# EAGLE design hackfest (EAGLE 9.6.2)
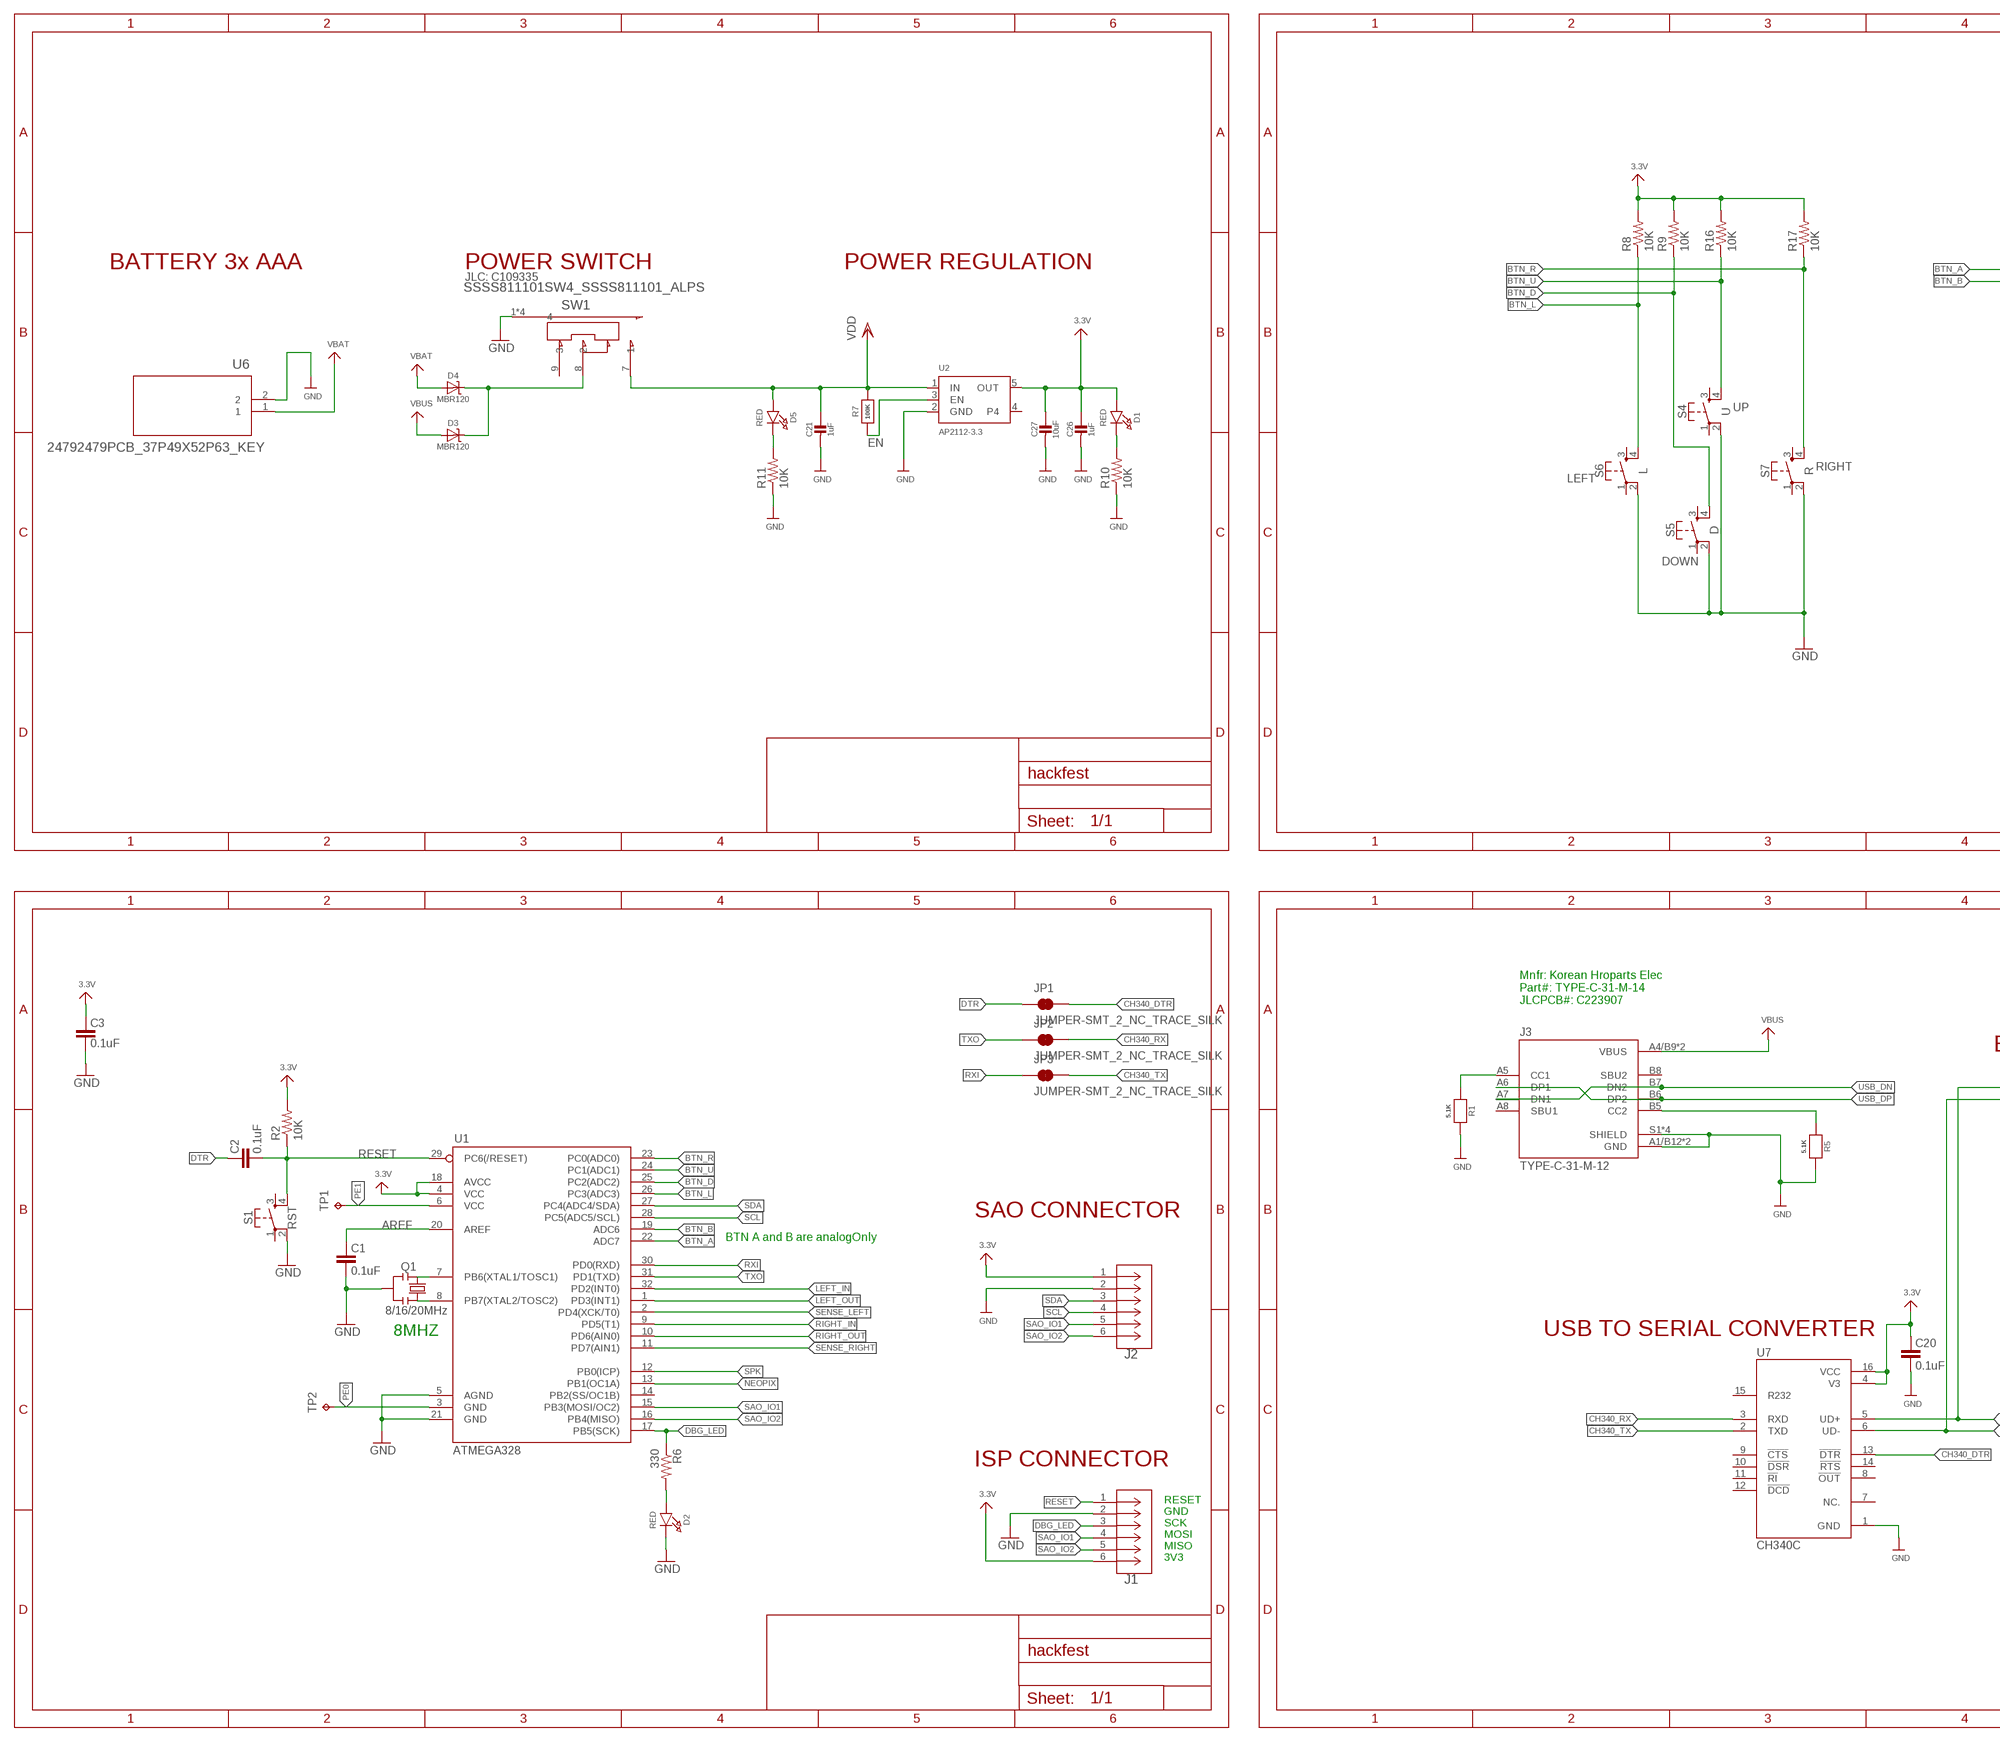
[diagram p0: schematic, sheet 1, part 1 of 2]
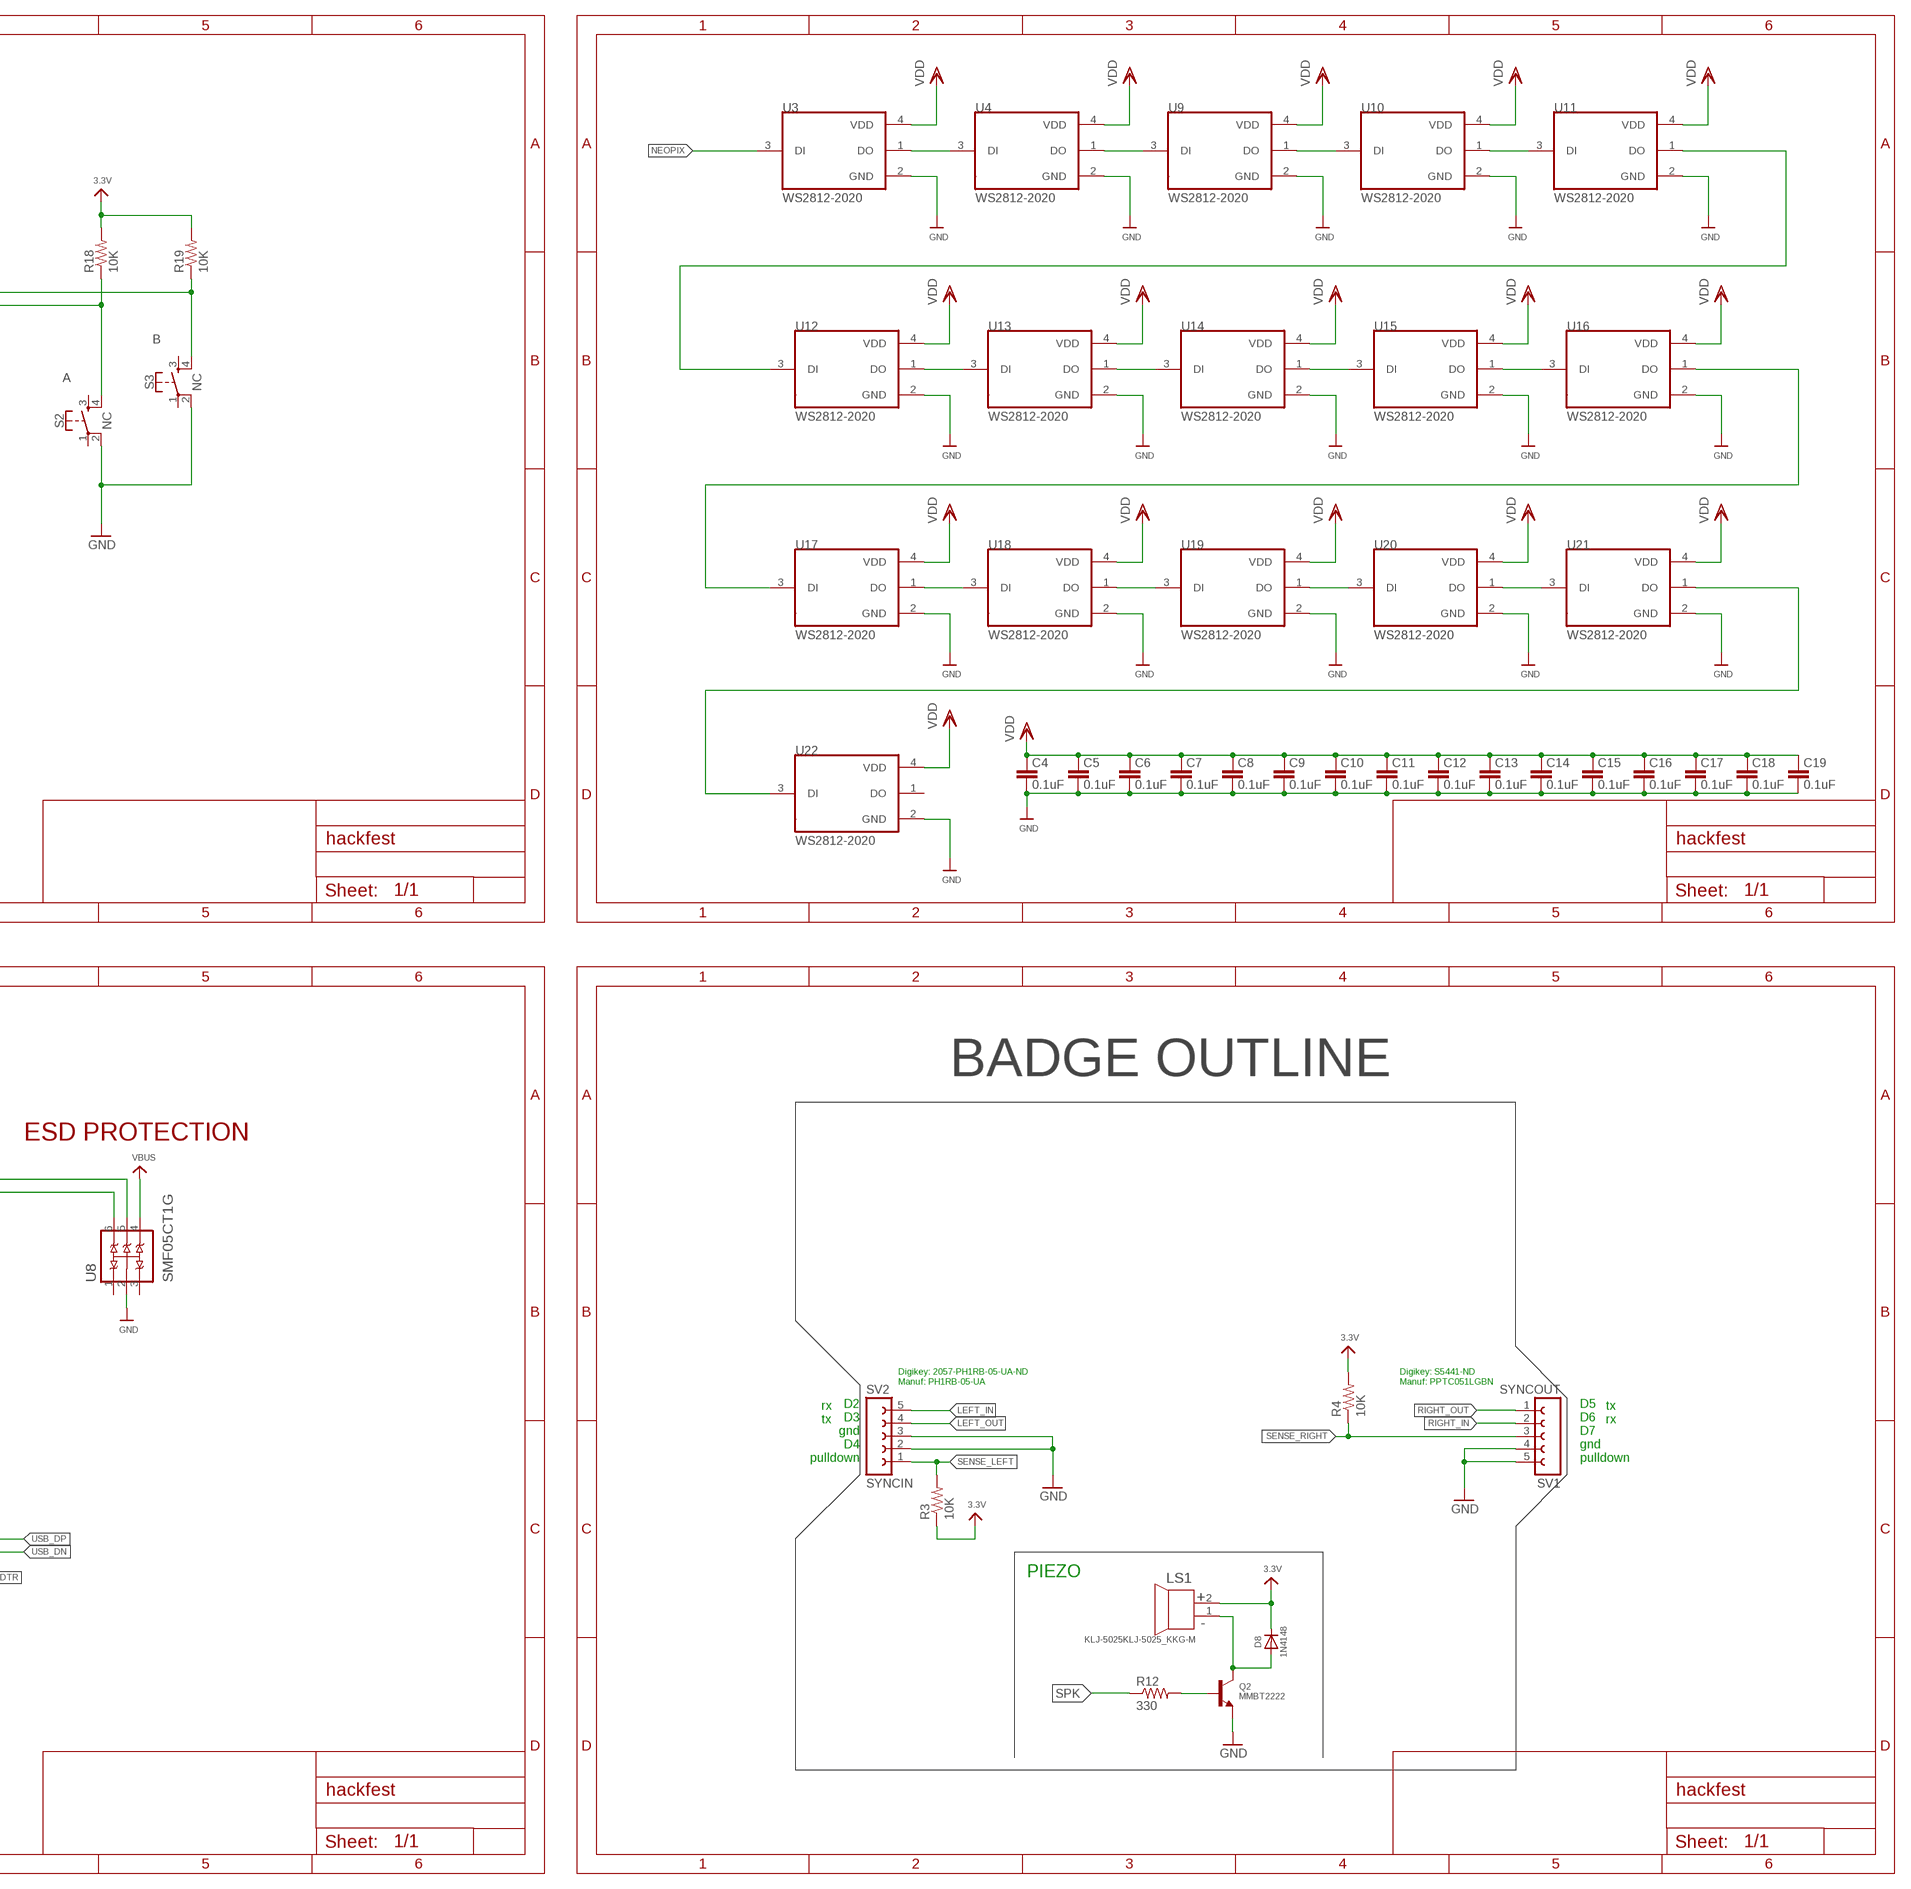
[diagram p1: schematic, sheet 1, part 2 of 2]

## Parts
C1  0.1uF  CAP0603-CAP  [0603-CAP]
C2  0.1uF  CAP0603-CAP  [0603-CAP]
C3  0.1uF  CAP0603-CAP  [0603-CAP]
C4  0.1uF  CAP0603-CAP  [0603-CAP]
C5  0.1uF  CAP0603-CAP  [0603-CAP]
C6  0.1uF  CAP0603-CAP  [0603-CAP]
C7  0.1uF  CAP0603-CAP  [0603-CAP]
C8  0.1uF  CAP0603-CAP  [0603-CAP]
C9  0.1uF  CAP0603-CAP  [0603-CAP]
C10  0.1uF  CAP0603-CAP  [0603-CAP]
C11  0.1uF  CAP0603-CAP  [0603-CAP]
C12  0.1uF  CAP0603-CAP  [0603-CAP]
C13  0.1uF  CAP0603-CAP  [0603-CAP]
C14  0.1uF  CAP0603-CAP  [0603-CAP]
C15  0.1uF  CAP0603-CAP  [0603-CAP]
C16  0.1uF  CAP0603-CAP  [0603-CAP]
C17  0.1uF  CAP0603-CAP  [0603-CAP]
C18  0.1uF  CAP0603-CAP  [0603-CAP]
C19  0.1uF  CAP0603-CAP  [0603-CAP]
C20  0.1uF  CAP0603-CAP  [0603-CAP]
C21  1uF  CAP_CERAMIC0603_NO  [0603-NO@1]
C26  1uF  CAP_CERAMIC0603_NO  [0603-NO@1]
C27  10uF  CAP_CERAMIC0805-NOOUTLINE  [0805-NO]
D1  RED  LED0805_NOOUTLINE  [CHIPLED_0805_NOOUTLINE]
D2  RED  LED0805_NOOUTLINE  [CHIPLED_0805_NOOUTLINE]
D3  MBR120  DIODE-SCHOTTKYSOD-123  [SOD-123]
D4  MBR120  DIODE-SCHOTTKYSOD-123  [SOD-123]
D5  RED  LED0805_NOOUTLINE  [CHIPLED_0805_NOOUTLINE]
D8  1N4148  DIODESOD-323  [SOD-323]
J1  SSW-103-22-F-D-VS-K-TRCON3_SSW-D-DUMZ_HDR_SAI  [CON3_SSW-D-DUMZ_HDR_SAI]
J2  SSW-103-22-F-D-VS-K-TRCON3_SSW-D-DUMZ_HDR_SAI  [CON3_SSW-D-DUMZ_HDR_SAI]
J3  TYPE-C-31-M-12  [HRO_TYPE-C-31-M-12]
JP1  JUMPER-SMT_2_NC_TRACE_SILK  [SMT-JUMPER_2_NC_TRACE_SILK]
JP2  JUMPER-SMT_2_NC_TRACE_SILK  [SMT-JUMPER_2_NC_TRACE_SILK]
JP3  JUMPER-SMT_2_NC_TRACE_SILK  [SMT-JUMPER_2_NC_TRACE_SILK]
LS1  KLJ-5025KLJ-5025_KKG-M  [KLJ-5025_KKG-M]
Q1  8/16/20MHz  RESONATOR1:1  [RESONATOR-SMD-1:1]
Q2  MMBT2222  TRANSISTOR_NPNWIDE  [SOT23-WIDE]
R1  5.1K  RESISTOR_0603_NOOUT  [0603-NO]
R2  10K  RESISTOR0603-RES  [0603-RES]
R3  10K  RESISTOR0603-RES  [0603-RES]
R4  10K  RESISTOR0603-RES  [0603-RES]
R5  5.1K  RESISTOR_0603_NOOUT  [0603-NO]
R6  330  RESISTOR0603-RES  [0603-RES]
R7  100K  RESISTOR_0603_NOOUT  [0603-NO]
R8  10K  RESISTOR0603-RES  [0603-RES]
R9  10K  RESISTOR0603-RES  [0603-RES]
R10  10K  RESISTOR0603-RES  [0603-RES]
R11  10K  RESISTOR0603-RES  [0603-RES]
R12  330  RESISTOR0603-RES  [0603-RES]
R16  10K  RESISTOR0603-RES  [0603-RES]
R17  10K  RESISTOR0603-RES  [0603-RES]
R18  10K  RESISTOR0603-RES  [0603-RES]
R19  10K  RESISTOR0603-RES  [0603-RES]
S1  RST  MOMENTARY-SWITCH-SPST-2-SMD-5.2MM  [TACTILE_SWITCH_SMD_5.2MM]
S2  NC  MOMENTARY-SWITCH-SPST-2-SMD-5.2MM  [TACTILE_SWITCH_SMD_5.2MM]
S3  NC  MOMENTARY-SWITCH-SPST-2-SMD-5.2MM  [TACTILE_SWITCH_SMD_5.2MM]
S4  U  MOMENTARY-SWITCH-SPST-2-SMD-5.2MM  [TACTILE_SWITCH_SMD_5.2MM]
S5  D  MOMENTARY-SWITCH-SPST-2-SMD-5.2MM  [TACTILE_SWITCH_SMD_5.2MM]
S6  L  MOMENTARY-SWITCH-SPST-2-SMD-5.2MM  [TACTILE_SWITCH_SMD_5.2MM]
S7  R  MOMENTARY-SWITCH-SPST-2-SMD-5.2MM  [TACTILE_SWITCH_SMD_5.2MM]
SV1  SYNCOUT  FE05W  [FE05W]
SV2  SYNCIN  FE05W  [FE05W]
SW1  SSSS811101SW4_SSSS811101_ALPS  [SW4_SSSS811101_ALPS]
TP1  TPB1,27  [B1,27]
TP2  TPB1,27  [B1,27]
U1  ATMEGA328  ATMEGA168  [TQFP32-08]
U2  AP2112-3.3  VREG_SOT23-5  [SOT23-5]
U3  WS2812-2020  [LED_WS2812-2020]
U4  WS2812-2020  [LED_WS2812-2020]
U6  24792479PCB_37P49X52P63_KEY  [2479PCB_37P49X52P63_KEY]
U7  CH340C  [SOIC127P600X180-16N]
U8  SMF05CT1G  [SOT65P210X110-6N]
U9  WS2812-2020  [LED_WS2812-2020]
U10  WS2812-2020  [LED_WS2812-2020]
U11  WS2812-2020  [LED_WS2812-2020]
U12  WS2812-2020  [LED_WS2812-2020]
U13  WS2812-2020  [LED_WS2812-2020]
U14  WS2812-2020  [LED_WS2812-2020]
U15  WS2812-2020  [LED_WS2812-2020]
U16  WS2812-2020  [LED_WS2812-2020]
U17  WS2812-2020  [LED_WS2812-2020]
U18  WS2812-2020  [LED_WS2812-2020]
U19  WS2812-2020  [LED_WS2812-2020]
U20  WS2812-2020  [LED_WS2812-2020]
U21  WS2812-2020  [LED_WS2812-2020]
U22  WS2812-2020  [LED_WS2812-2020]

## Nets
3.3V: C3.2 C20.2 C26.1 C27.1 D1.A D8.C J1.6 J2.1 LS1.2 R2.2 R3.1 R4.2 R8.2 R9.2 R16.2 R17.2 R18.2 R19.2 U1.4(VCC) U1.18(AVCC) U2.5(OUT) U7.4(V3) U7.16(VCC)
AREF: C1.2 U1.20(AREF)
BTN_A: R19.1 S3.4 U1.22(ADC7)
BTN_B: R18.1 S2.4 U1.19(ADC6)
BTN_D: R9.1 S5.4 U1.25(PC2(ADC2))
BTN_L: R8.1 S6.4 U1.26(PC3(ADC3))
BTN_R: R17.1 S7.4 U1.23(PC0(ADC0))
BTN_U: R16.1 S4.4 U1.24(PC1(ADC1))
CH340_DTR: JP1.2 U7.13(!DTR)
CH340_RX: JP2.2 U7.3(RXD)
CH340_TX: JP3.2 U7.2(TXD)
DBG_LED: J1.3 R6.1 U1.17(PB5(SCK))
DTR: C2.2 JP1.1
EN: R7.1 U2.3(EN)
GND [vcc]: C1.1 C3.1 C4.1 C5.1 C6.1 C7.1 C8.1 C9.1 C10.1 C11.1 C12.1 C13.1 C14.1 C15.1 C16.1 C17.1 C18.1 C19.1 C20.1 C21.2 C26.2 C27.2 D2.C J1.2 J2.2 J3.A1/B12(GND) J3.B1/A12(GND) J3.S1(SHIELD) J3.S2(SHIELD) J3.S3(SHIELD) J3.S4(SHIELD) Q1.2 Q2.2(E) R1.2 R5.2 R10.1 R11.1 S1.2 S2.2 S3.2 S4.2 S5.2 S6.2 S7.2 SV1.4 SV1.5 SV2.2 SV2.3 SW1.1 SW1.2 SW1.3 SW1.4 U1.5(AGND) U1.21(GND) U2.2(GND) U3.2(GND) U4.2(GND) U6.2 U7.1(GND) U8.2(A) U9.2(GND) U10.2(GND) U11.2(GND) U12.2(GND) U13.2(GND) U14.2(GND) U15.2(GND) U16.2(GND) U17.2(GND) U18.2(GND) U19.2(GND) U20.2(GND) U21.2(GND) U22.2(GND)
LEFT_IN: SV2.5 U1.32(PD2(INT0))
LEFT_OUT: SV2.4 U1.1(PD3(INT1))
N$1: Q1.3 U1.8(PB7(XTAL2/TOSC2))
N$2: Q1.1 U1.7(PB6(XTAL1/TOSC1))
N$3: U4.1(DO) U9.3(DI)
N$4: U9.1(DO) U10.3(DI)
N$5: U3.1(DO) U4.3(DI)
N$6: U10.1(DO) U11.3(DI)
N$7: D2.A R6.2
N$8: U11.1(DO) U12.3(DI)
N$9: U12.1(DO) U13.3(DI)
N$10: U13.1(DO) U14.3(DI)
N$11: U14.1(DO) U15.3(DI)
N$12: U15.1(DO) U16.3(DI)
N$13: U16.1(DO) U17.3(DI)
N$14: U17.1(DO) U18.3(DI)
N$15: U18.1(DO) U19.3(DI)
N$16: U19.1(DO) U20.3(DI)
N$17: U20.1(DO) U21.3(DI)
N$20: U21.1(DO) U22.3(DI)
N$24: D8.A LS1.1 Q2.3(C)
N$25: Q2.1(B) R12.2
N$27: J3.B5(CC2) R5.1
N$30: J3.A5(CC1) R1.1
N$34: D3.C D4.C SW1.8
N$35: D5.C R11.2
N$36: D1.C R10.2
NEOPIX: U1.13(PB1(OC1A)) U3.3(DI)
PE0: TP2.TP U1.3(GND)
PE1: TP1.TP U1.6(VCC)
RESET: C2.1 J1.1 R2.1 S1.4 U1.29(PC6(/RESET))
RIGHT_IN: SV1.2 U1.9(PD5(T1))
RIGHT_OUT: SV1.1 U1.10(PD6(AIN0))
RXI: JP3.1 U1.30(PD0(RXD))
SAO_IO1: J1.4 J2.5 U1.15(PB3(MOSI/OC2))
SAO_IO2: J1.5 J2.6 U1.16(PB4(MISO))
SCL: J2.4 U1.28(PC5(ADC5/SCL))
SDA: J2.3 U1.27(PC4(ADC4/SDA))
SENSE_LEFT: R3.2 SV2.1 U1.2(PD4(XCK/T0))
SENSE_RIGHT: R4.1 SV1.3 U1.11(PD7(AIN1))
SPK: R12.1 U1.12(PB0(ICP))
TXO: JP2.1 U1.31(PD1(TXD))
USB_DN: J3.A7(DN1) J3.B7(DN2) U7.6(UD-) U8.6(C5)
USB_DP: J3.A6(DP1) J3.B6(DP2) U7.5(UD+) U8.5(C4)
VBAT: D4.A U6.1
VBUS: D3.A J3.A4/B9(VBUS) J3.B4/A9(VBUS) U8.4(C3)
VDD: C4.2 C5.2 C6.2 C7.2 C8.2 C9.2 C10.2 C11.2 C12.2 C13.2 C14.2 C15.2 C16.2 C17.2 C18.2 C19.2 C21.1 D5.A R7.2 SW1.7 U2.1(IN) U3.4(VDD) U4.4(VDD) U9.4(VDD) U10.4(VDD) U11.4(VDD) U12.4(VDD) U13.4(VDD) U14.4(VDD) U15.4(VDD) U16.4(VDD) U17.4(VDD) U18.4(VDD) U19.4(VDD) U20.4(VDD) U21.4(VDD) U22.4(VDD)
Unconnected: J3.A8(SBU1) J3.B8(SBU2) S1.1 S1.3 S2.1 S2.3 S3.1 S3.3 S4.1 S4.3 S5.1 S5.3 S6.1 S6.3 S7.1 S7.3 SW1.9 U1.14(PB2(SS/OC1B)) U2.4 U7.7(NC.) U7.8(!OUT) U7.9(!CTS) U7.10(!DSR) U7.11(!RI) U7.12(!DCD) U7.14(!RTS) U7.15(R232) U8.1(C1) U8.3(C2) U22.1(DO)

## Notes on the sheet
- BATTERY 3x AAA | POWER SWITCH | POWER REGULATION
- JLC: C109335
- B
- A
- UP
- RIGHT
- LEFT
- DOWN
- BADGE OUTLINE
- Mnfr: Korean Hroparts Elec
  Part#: TYPE-C-31-M-14
  JLCPCB#: C223907
- ESD PROTECTION
- SAO CONNECTOR
- BTN A and B are analogOnly
- Digikey: 2057-PH1RB-05-UA-ND
  Manuf: PH1RB-05-UA
- Digikey: S5441-ND
  Manuf: PPTC051LGBN
- rx
  tx
- tx
  rx
- 8MHZ | USB TO SERIAL CONVERTER
- D2
  D3
  gnd
  D4
  pulldown
- D5
  D6
  D7
  gnd
  pulldown
- PIEZO
- ISP CONNECTOR
- RESET
  GND
  SCK
  MOSI
  MISO
  3V3

## Library data of the parts
C1-C20 = SparkFun:CAP: Capacitor Standard 0603 ceramic capacitor, and 0.1" leaded capacitor.
C21 C26 C27 = microbuilder:CAP_CERAMIC: Ceramic Capacitors For new designs, use the packages preceded by an '_' character since they are more reliable: The following footprints should be used on most boards: _0402 - Standard footprint for regular board layouts _0603 - Standard footprint for regular board layouts _0805 - Standard footprint for regular board layouts _1206 - Standard footprint for regular board layouts For extremely tight-pitch boards where space is at a premium, the following 'micro-pitch' footprints can be used (smaller pads, no silkscreen outline, etc.): _0402MP - Micro-pitch footprint for very dense/compact boards _0603MP - Micro-pitch footprint for very dense/compact boards _0805MP - Micro-pitch footprint for very dense/compact boards _1206MP - Micro-pitch footprint for very dense/compact boards
D1 D2 D5 = microbuilder:LED: LED 0603 - 0603 Surface Mount Package 2mA: Green LED - Low Power (3.9mcd, 2ma, 1.7Vf) - Digikey: 475-2709-2-ND Orange LED - Low Power (9.8mcd, 2ma, 1.8Vf) - Digikey: 475-1194-2-ND Red LED - Low Power (5mcd, 2ma, 1.8Vf) - Digikey: 475-1195-2-ND Yellow LED - Low Power (7mcd, 2ma, 1.8Vf) - Digikey: 475-1196-2-ND 5mA: Blue LED - Low Power (17mcd, 5ma, 2.9Vf) - Digikey: LNJ937W8CRACT-ND 0805 - 0805 Surface Mount Package 2mA: Red LED (8.8mcd, 2mA, 1.8Vf, Clear) - Low Power [Digikey: 475-2510-1-ND] Green LED (5mcd, 2mA, 1.8Vf, Clear) - Low Power [Digikey: 475-2730-1-ND] Yellow LED (11.3mcd, 2mA, 1.8Vf, Clear) - Low Power [Digikey: 475-2555-1-ND] 20mA: Red LED (104mcd, 20mA, Diffused) - LS R976 [Digikey: 475-1278-6-ND] Red LED (12mcd, 20mA, 2.0Vf, Clear) - APT2012EC [Digikey: 754-1128-1-ND] Green LED (15mcd, 20mA, 2.2Vf, Clear) - APT2012GC [Digikey: 754-1131-1-ND] Orange LED (160mcd, 20mA, 2.1Vf, Clear) - APT2012SECK [Digikey: 754-1130-1-ND] 1206 - 1206 Surface Mount Package Green LED (26mcd, 20mA, Diffused) - LG N971 [Digikey: 475-1407-6-ND] Red LED (15mcd, 20mA, Diffused) - LH N974 [Digikey: 475-1416-6-ND] Cree - Cree High-Power Surface Mount LEDs XPEBWT-L1-0000-00D50 - White 111lm 350mA 2.9Vf 6200K 110° XTEAWT-00-0000-00000LEE3 - White 114lm 350mA 2.85Vf 5000K 115° Everlight - Everlight 45-21 Series Surface Mount LEDs 45-21/QK2C-B2832AC2CB2/2T - Warm White 2000mcd 20mA 3.25Vf 3050K 120° 45-21/LK2C-B38452C4CB2/2T - Nuetral White 2000mcd 20mA 3.25Vf 4150K 120° 45-21/LK2C-B50634C6CB2/2T - Cold White 2200mcd 20mA 3.25Vf 5650K 120° PLCC2 Reverse Mount LS T77K-J1L2-1-0-2-R18-Z - Red 11.25mcd 2mA 1.8Vf 630nm 120° LO T77K-L1M2-24-Z - Orange 19.6mcd 2mA 1.8Vf 606nm 120° LY T77K-K2M1-26-Z - Yellow 15.7mcd 2mA 1.8Vf 587nm 120°
D3 D4 = microbuilder:DIODE-SCHOTTKY
D8 = microbuilder:DIODE: Diode SMA Model Volts Amps Type Vf Ir Digikey # Notes SSA34-E3 40V 3A Schottky 480mV @ 3A 200uA @ 40V SSA34-E3/61TGITR-ND CDBA120-G 20V 1A Schottky 500mV @ 1A 500uA @ 20V 641-1014-6-ND REEL MBRA210 10V 2A Schottky 350mV @ 2A 700uA @ 10V MBRA210LT3 SOD-123 Model Volts Amps Type Vf Ir Order # Notes BAT54T1G 30V 200mA Schottky 800mV @ 200mA 2uA @ 25V BAT54T1GOSTR-ND B0530W 30V 500mA Schottky 430mV @ 500mA 130uA @ 30V B0530W-FDICT-ND REEL MBR120 20V 1A Schottky 340mV @ 1A MBR120VLSFT1GOSCT-ND SOD-323 Model Volts Amps Type Vf Ir Order # Notes PMEG2005EJ 20V 500mA Schottky 355mV @ 500mA 568-4110-1-ND ZLLS410 10V 570mA Schottky 380mV @ 570mA ZLLS410CT-ND 1N4148WS 75V 150mA Silicon/Simple 1V 1N4148WSFSCT-ND REEL SOD-523 Model Volts Amps Type Vf Ir Order # Notes BAT54XV2 30V 200mA Schottky 0.8V @ 100mA BAT54XV2CT-ND TB751S 30V 30mA Schottky RB751S-40TE61CT-ND SOT23-R/W (R = Solder Paste/Reflow Ovens, W = Hand-Soldering) Model Volts Amps Type Vf Ir Order # Notes BAT54FILM 40V 300mA Schottky 497-7162-1-ND POWERDI-5 Model Volts Amps Type Vf Ir Order # Notes PDS560 60V 5A Schottky 670mV @ 5A 150uA @ 60V PDS560DICT-ND
J1 J2 = SSW-103-22-F-D-VS-K-TR:SSW-103-22-F-D-VS-K-TR; COPYRIGHT: Copyright (C) 2022 Ultra Librarian. All rights reserved.; DIGI-KEY_PART_NUMBER_1: SAM14622CT-ND; DIGI-KEY_PART_NUMBER_2: SAM14622DKR-ND; DIGI-KEY_PART_NUMBER_3: SAM14622TR-ND; MANUFACTURER_PART_NUMBER: SSW-103-22-F-D-VS-K-TR; MFR_NAME: Samtec Inc
J3 = TYPE-C-31-M-12:TYPE-C-31-M-12; MANUFACTURER: HRO Electronics Co., Ltd.; MAXIMUM_PACKAGE_HEIGHT: 3.26 mm; PARTREV: 2020.12.08; SNAPEDA_PN: TYPE-C-31-M-12; STANDARD: Manufacturer Recommendations
JP1-JP3 = SparkFun-Jumpers:JUMPER-SMT_2_NC_TRACE: Normally closed trace jumper This jumper has a trace between two pads so it's normally closed (NC). Use a razor knife to open the connection. For best results follow the IPC guidelines for cutting traces: Cutout at least 0.063 mm (0.005 in). Remove all loose material to clean up the cut area. Seal the cut with an approved epoxy. Reapply solder to reclose the connection.
LS1 = KLJ-5025_KKG:KLJ-5025; COPYRIGHT: Copyright (C) 2024 Ultra Librarian. All rights reserved.; MANUFACTURER_PART_NUMBER: KLJ-5025; MFR_NAME: KELIKING
Q1 = Testing:RESONATOR: Resonator Small SMD resonator. This is the itty bitty 10/20MHz resonators with built in caps. CSTCE10M0G55 and CSTCE20M0V53. Footprint for SMD has been used in SFE production for years, and does work okay. 1:1 is an attempt to get larger fillets on the sides so it will be easier to inspect these solders in our AOI machine. The pads have been minimized to match the actual metal under the resonator. To see this relation, it includes an image import of the bottom side of the component. Imported to scale on layer 200.
Q2 = microbuilder:TRANSISTOR_NPN: NPN Transistor Transistor (NPN) 500mA 45V - BC817 [Digikey: 568-1631-1-ND] Transistor (NPN) 500mA 45V - BC817,215 [Mouser: 771-BC817-T/R] SOT23-R - SOT23 footprint optimised for use with solder paste and reflow ovens. SOT23-W - SOT23 footprint optimised for hand-soldering (larger pads).
R1 R5 R7 = microbuilder:RESISTOR: Resistors For new designs, use the packages preceded by an '_' character since they are more reliable: The following footprints should be used on most boards: _0402 - Standard footprint for regular board layouts _0603 - Standard footprint for regular board layouts _0805 - Standard footprint for regular board layouts _1206 - Standard footprint for regular board layouts For extremely tight-pitch boards where space is at a premium, the following 'micro-pitch' footprints can be used (smaller pads, no silkscreen outline, etc.): _0402MP - Micro-pitch footprint for very dense/compact boards _0603MP - Micro-pitch footprint for very dense/compact boards _0805MP - Micro-pitch footprint for very dense/compact boards _1206MP - Micro-pitch footprint for very dense/compact boards
R2-R4 R6 R8-R12 R16-R19 = SparkFun:RESISTOR: Resistor Basic schematic elements and footprints for 0603, 1206, and PTH resistors.
S1-S7 = SparkFun-Switches:MOMENTARY-SWITCH-SPST-2: Momentary Switch (Pushbutton) - SPST - Two Circuits Normally-open (NO) SPST momentary switches (buttons, pushbuttons). Schematic symbol includes two switch circuits. Variants SMD-4.6MMX2.8MM - 4.60mm x 2.80mm Tactile Momentary Button Switch - Used on SparkFun SAMD21 Mini Breakout <https://www.sparkfun.com/products/13664> SMD-5.2MM - Mini Pushbutton Switch - SMD <https://www.sparkfun.com/products/8720> - Used on Arduino Pro Mini <https://www.sparkfun.com/products/11114>; PROD_ID: SWCH-08247; SF_SKU: COM-08720
SV1 SV2 = con-lsta:FE05W: FEMALE HEADER; OC_FARNELL: unknown; OC_NEWARK: unknown
SW1 = SSSS811101:SSSS811101; COPYRIGHT: Copyright (C) 2023 Ultra Librarian. All rights reserved.; MANUFACTURER_PART_NUMBER: SSSS811101; MFR_NAME: Alps Electric
TP1 TP2 = testpad:TP: Test pad
U1 = SparkFun:ATMEGA168
U2 = microbuilder:VREG_SOT23-5: SOT23-5 Fixed Voltage Regulators Part Current Out V Out V In V Dropout θJA (°C/W) TJ (°C) Digikey Part No. ADP121 150mA 3.3V 3.4-5.5V 0.09V @ 150mA -- -- ADP121-AUJZ33R7CT-ND ADP121 150mA 3.0V 3.1-5.5V 0.09V @ 150mA -- -- ADP121-AUJZ30R7CT-ND ADP122 300mA 3.3V 3.4-5.5V 0.085V @ 300mA -- -- ADP122AUJZ-3.3-R7CT-ND ADP1712 300mA 3.3V 3.5-5.5V 0.17V @ 300mA -- -- ADP1712AUJZ-3.3-R7TR-ND AP7311 (Low Cost) 150mA 3.3V 3.5-6V 0.15V @ 150mA -- -- AP7311-33WG-7DICT-ND LD39015M18R 150mA 1.8V 1.9V-5.5V 0.08V @ 100mA -- -- 497-6977-1-ND LP2985A-33DBVR 150mA 3.3V 3.3-16V 0.28V @ 150mA 206 150 296-18479-1-ND MCP1824T-3302E/OT 300mA 3.3V 3.5V-6V 0.2V @ 300mA -- -- MCP1824T-3302E/OTCT-ND MIC5205-2.5YM5 TR 150mA 2.5V 2.7-16V 0.165V @ 150mA -- -- 576-1257-2-ND MIC5205-3.0YM5 TR 150mA 3.0V 3.2V-16V 0.165V @ 150mA -- -- 576-1258-2-ND MIC5205-3.3YM5 TR 150mA 3.3V 3.5V-16V 0.165V @ 150mA -- -- 576-1259-2-ND TPS780330220 150mA 3.3V+2.2V 3.6-5.5V 250mV Max -- -- 296-23332-1-ND TDA3663/N1,135 100mA 3.3V 3.5-45V 0.18V @ 50mA -- -- 568-5343-1-ND Max operating temp can be calculated using θJA, TJ (max junction temperature), and power in watts. Set the "Maximum Ambient Temperature" until it reaches TJ ("Max Junction Temperature"), which is the absolute limit for safe use of the regulator: Heat Sink Temperature Calculator <http://www.daycounter.com/Calculators/Heat-Sink-Temperature-Calculator.phtml> For example, With 12V source into a 3.3V LP2985 and a 30mA load, we are dissipating (12V-3.3V) * 0.03A = 0.261W. With a θJA of 206 °C/W, a TJ of 150°C, and 261mW we can safely use the chip without a heat sink up to 75°C (=147.1°C Junction Temperature).
U3 U4 U9-U22 = WS2812-2020:WS2812-2020: Intelligent control LED integrated light source Check availability <https://pricing.snapeda.com/parts/WS2812-2020/Worldsemi/view-part?ref=eda>; AVAILABILITY: Not in stock; DESCRIPTION: Intelligent control LED light source, SMD-4; MF: Worldsemi; MP: WS2812-2020; PACKAGE: Package; PRICE: None
U6 = 36-2479-ND_AAA-3x:2479; COPYRIGHT: Copyright (C) 2022 Ultra Librarian. All rights reserved.; DIGI-KEY_PART_NUMBER_1: 1528-1350-ND; DIGI-KEY_PART_NUMBER_2: 2183-2479-ND; DIGI-KEY_PART_NUMBER_3: 2479K-ND; DIGI-KEY_PART_NUMBER_4: 36-2479-ND; DIGI-KEY_PART_NUMBER_5: 36-2479-NDL; MANUFACTURER_PART_NUMBER: 2479; MFR_NAME: Keystone Electronics
U7 = CH340C:CH340C: USB to serial chip CH340 Check prices <https://pricing.snapeda.com/parts/CH340C/WCH/view-part?ref=eda>; AVAILABILITY: Not in stock; DESCRIPTION: USB to serial chip CH340; MF: WCH; MP: CH340C; PACKAGE: None; PRICE: None
U8 = SMF05CT1G:SMF05CT1G: SMF05C Series 7.2 V 100 W 5-Line Transient Voltage Suppressor Array - SC-88 Check prices <https://pricing.snapeda.com/parts/SMF05CT1G/ON%20Semiconductor/view-part?ref=eda>; AVAILABILITY: In Stock; DESCRIPTION: 12.5V Clamp 8A (8/20µs) Ipp Tvs Diode Surface Mount SC-88/SC70-6/SOT-363; MF: ON Semiconductor; MP: SMF05CT1G; PACKAGE: SC-88-6 ON Semiconductor; PRICE: None; PURCHASE-URL: https://pricing.snapeda.com/search/part/SMF05CT1G/?ref=eda

## Net classes
1 vcc: width 0.254 mm

## Board
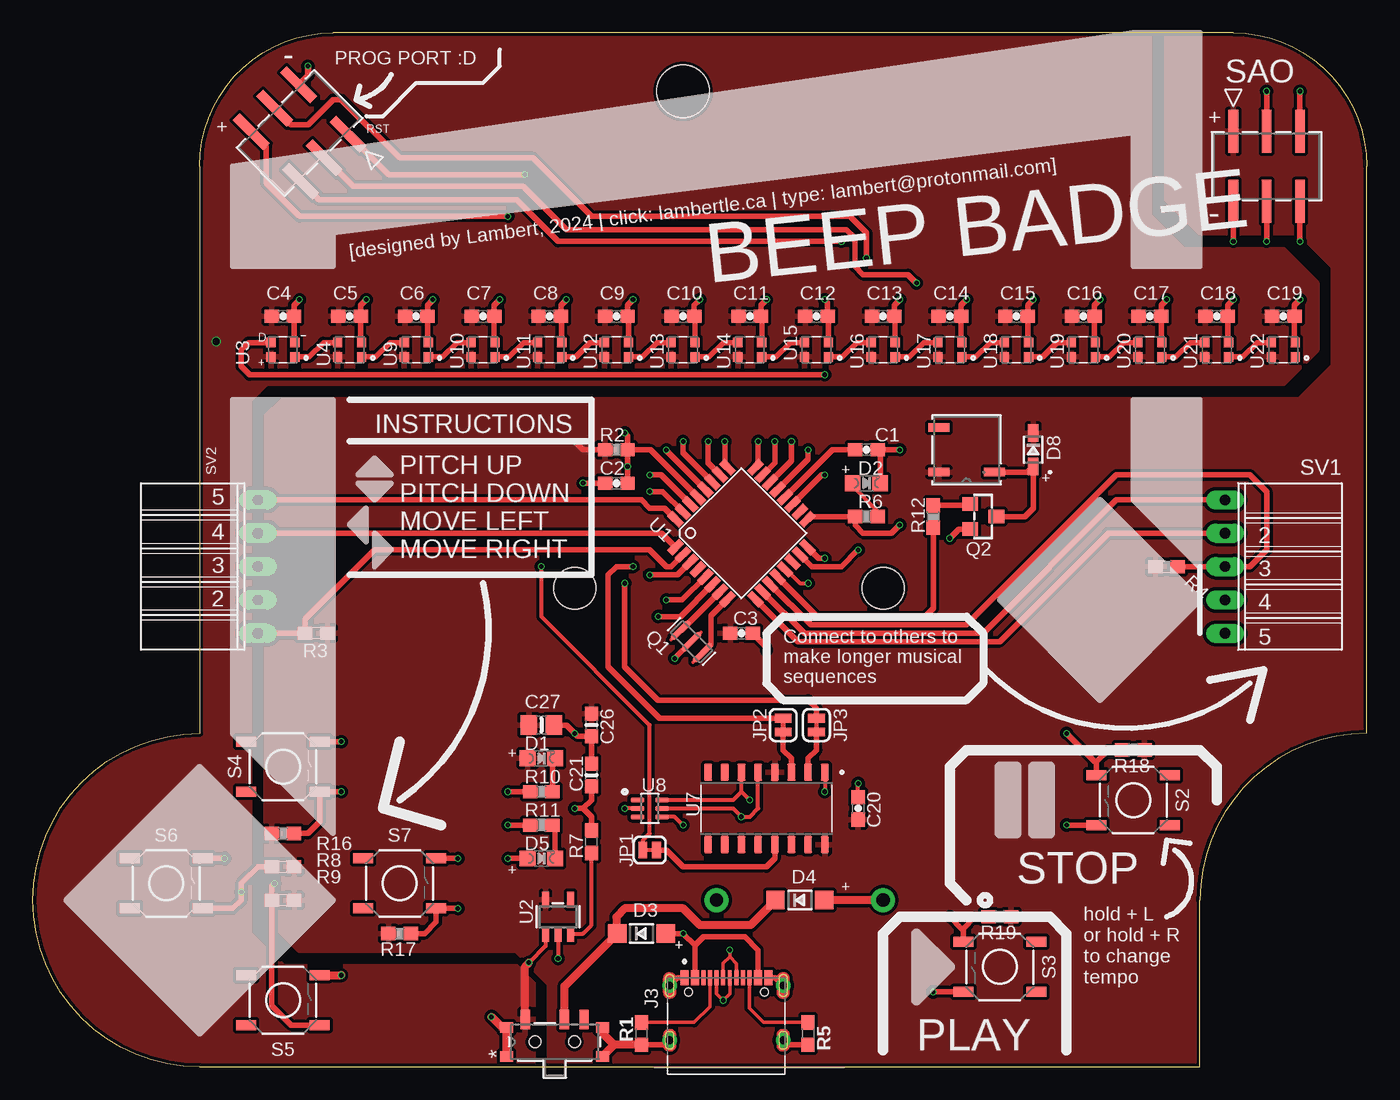
[diagram p2: board, top side]
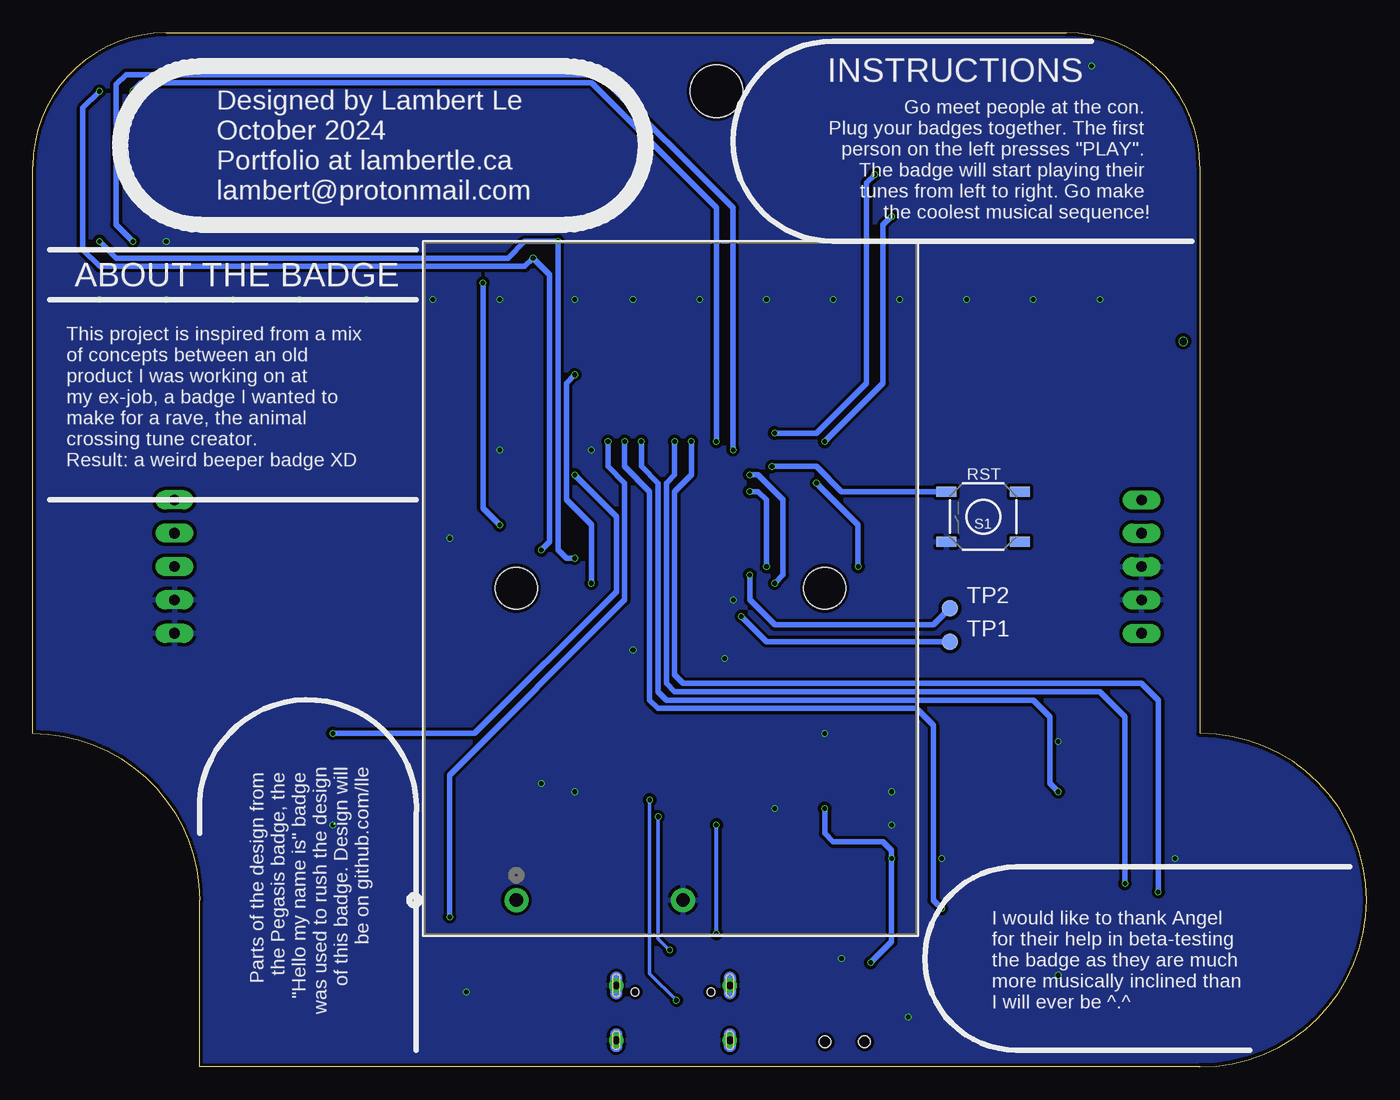
[diagram p3: board, bottom side, seen from below]

Size 101.6 x 78.74 mm. Coordinates in mm from the lower left corner, seen from the top.
Outline: 12.7,0 88.9,0 88.9,12.7 arc-90 101.6,25.4 101.6,68.58 arc90 91.44,78.74 22.86,78.74 arc90 12.7,68.58 12.7,25.4 arc180 12.7,0
Copper layers (1*16): Top 0.035mm / dielectric 1.6mm / Bottom 0.035mm
Design rules "jlcpcb-2layers": minimum track width 5mil, minimum drill 0.3mm, track to track 5mil, track to pad 5mil, pad to pad 5mil, via to via 5mil, smd to smd 5mil, copper to edge 0.2mm, drill to drill 6mil, minimum pad ring 10mil, minimum via ring 3mil, stop-mask expansion 4mil, vias tented up to drill 0mil, thermal gap 10mil
Holes 4 mm at 49.53,74.3

### Footprints (pad centres in the part's own frame; a part is rotated, then mirrored left to right if it is on the bottom)
0603-CAP = smd 1.1 x 1: 1 -0.85,0; 2 0.85,0
0603-NO@1 = smd 1.075 x 1: 1 -0.85,0; 2 0.85,0
0805-NO = smd 1.24 x 1.5: 1 -0.95,0; 2 0.95,0
CHIPLED_0805_NOOUTLINE = smd 1.2 x 1.2: A 0,-1.05; C 0,1.05
SOD-123 = smd 1.4 x 1.4: A 1.85,0; C -1.85,0
SOD-323 = smd 1.35 x 0.8: A 1.27,0; C -1.27,0
CON3_SSW-D-DUMZ_HDR_SAI = smd 0.737 x 3.251: 1 2.54,-2.667; 2 2.54,2.667; 3 0,-2.667; 4 0,2.667; 5 -2.54,-2.667; 6 -2.54,2.667
HRO_TYPE-C-31-M-12 = smd 0.6 x 1.14: A1/B12 -3.2,4.75; A4/B9 -2.4,4.75; B1/A12 3.2,4.75; B4/A9 2.4,4.75 | smd 0.3 x 1.14: A5 -1.25,4.75; A6 -0.25,4.75; A7 0.25,4.75; A8 1.25,4.75; B5 1.75,4.75; B6 0.75,4.75; B7 -0.75,4.75; B8 -1.75,4.75 | drill 0.6 pad 0.9: S1 -4.325,4.17; S2 4.325,4.17; S3 -4.325,0; S4 4.325,0 | hole 0.6: -2.89,3.68; 2.89,3.68
SMT-JUMPER_2_NC_TRACE_SILK = smd 0.66 x 1.27: 1 -0.521,0; 2 0.521,0
KLJ-5025_KKG-M = smd 1.6 x 0.66: 1 -2.108,1.7; 2 2.108,1.7; 3 2.108,-1.7
RESONATOR-SMD-1:1 = smd 0.45 x 1.905: 1 -1.2,0; 2 0,0; 3 1.2,0
SOT23-WIDE = smd 1 x 1.2: 1 -0.95,-1; 2 0.95,-1; 3 0,1
0603-NO = smd 1.1 x 1: 1 -0.85,0; 2 0.85,0
0603-RES = smd 1.1 x 1: 1 -0.85,0; 2 0.85,0
TACTILE_SWITCH_SMD_5.2MM = smd 1.524 x 0.762: 1 -2.794,1.905; 2 2.794,1.905; 3 -2.794,-1.905; 4 2.794,-1.905
FE05W = drill 0.813 long: 1 -5.08,0; 2 -2.54,0; 3 0,0; 4 2.54,0; 5 5.08,0
SW4_SSSS811101_ALPS = smd 0.813 x 0.991: 1 -1.1,3.65; 2 -1.1,-3.65; 3 1.1,-3.65; 4 1.1,3.65 | smd 1.499 x 0.711: 7 1.71,2.243; 8 1.71,-0.742; 9 1.71,-2.24 | hole 0.9: 0,-1.5; 0,1.5
B1,27 = smd 1.27 x 1.27: TP 0,0
TQFP32-08 = smd 1.27 x 0.559: 1 -4.293,2.8; 2 -4.293,2; 3 -4.293,1.2; 4 -4.293,0.4; 5 -4.293,-0.4; 6 -4.293,-1.2; 7 -4.293,-2; 8 -4.293,-2.8; 17 4.293,-2.8; 18 4.293,-2; 19 4.293,-1.2; 20 4.293,-0.4; 21 4.293,0.4; 22 4.293,1.2; 23 4.293,2; 24 4.293,2.8 | smd 0.559 x 1.27: 9 -2.8,-4.293; 10 -2,-4.293; 11 -1.2,-4.293; 12 -0.4,-4.293; 13 0.4,-4.293; 14 1.2,-4.293; 15 2,-4.293; 16 2.8,-4.293; 25 2.8,4.293; 26 2,4.293; 27 1.2,4.293; 28 0.4,4.293; 29 -0.4,4.293; 30 -1.2,4.293; 31 -2,4.293; 32 -2.8,4.293
SOT23-5 = smd 0.55 x 1.2: 1 -0.95,-1.3; 2 0,-1.3; 3 0.95,-1.3; 4 0.95,1.3; 5 -0.95,1.3
LED_WS2812-2020 = smd 0.7 x 0.7: 1 -0.915,0.55; 2 -0.915,-0.55; 3 0.915,-0.55; 4 0.915,0.55
2479PCB_37P49X52P63_KEY = drill 1.016 pad 1.524: 1 0,0; 2 12.7,0 | hole 3.2: 0,23.749; 23.495,23.749
SOIC127P600X180-16N = smd 1.31 x 0.62: 1 -2.75,4.445; 2 -2.75,3.175; 3 -2.75,1.905; 4 -2.75,0.635; 5 -2.75,-0.635; 6 -2.75,-1.905; 7 -2.75,-3.175; 8 -2.75,-4.445; 9 2.75,-4.445; 10 2.75,-3.175; 11 2.75,-1.905; 12 2.75,-0.635; 13 2.75,0.635; 14 2.75,1.905; 15 2.75,3.175; 16 2.75,4.445
SOT65P210X110-6N = smd 1.06 x 0.39: 1 -0.935,0.65; 2 -0.935,0; 3 -0.935,-0.65; 4 0.935,-0.65; 5 0.935,0; 6 0.935,0.65

### Placement (x,y rotation side)
C1  63.5,46.99 180 top
C2  44.45,44.45 180 top
C3  53.98,33.02 180 top
C4  19.05,57.15 180 top
C5  24.13,57.15 180 top
C6  29.21,57.15 180 top
C7  34.29,57.15 180 top
C8  39.37,57.15 180 top
C9  44.45,57.15 180 top
C10  49.53,57.15 180 top
C11  54.61,57.15 180 top
C12  59.69,57.15 180 top
C13  64.77,57.15 180 top
C14  69.85,57.15 180 top
C15  74.93,57.15 180 top
C16  80.01,57.15 180 top
C17  85.09,57.15 180 top
C18  90.17,57.15 180 top
C19  95.25,57.15 180 top
C20  62.86,19.68 270 top
C21  42.55,22.23 90 top
C26  42.55,26.04 270 top
C27  38.73,26.04 0 top
D1  38.73,23.5 270 top
D2  63.5,44.45 270 top
D3  46.35,10.16 0 top
D4  58.42,12.7 0 top
D5  38.73,15.88 270 top
D8  76.2,46.99 270 top
J1  20.32,71.12 45 top
J2  93.98,68.58 180 top
J3  52.83,2.03 0 top
JP1  46.99,16.51 0 top
JP2  57.15,26.04 270 top
JP3  59.69,26.04 270 top
LS1  71.12,46.99 180 top
Q1  50.16,32.38 315 top
Q2  72.39,41.91 270 top
R1  46.35,2.54 270 top
R2  44.45,46.99 180 top
R3  21.59,33.02 180 top
R4  86.36,38.1 180 top
R5  59.05,2.54 270 top
R6  63.5,41.91 0 top
R7  42.55,17.14 90 top
R8  19.05,15.24 0 top
R9  19.05,12.7 0 top
R10  38.73,20.95 0 top
R11  38.73,18.41 0 top
R12  68.58,41.91 90 top
R16  19.05,17.78 180 top
R17  27.94,10.16 180 top
R18  83.82,24.13 0 top
R19  73.66,11.43 0 top
S1  29.21,41.91 180 bottom
S2  83.82,20.32 180 top
S3  73.66,7.62 180 top
S4  19.05,22.86 0 top
S5  19.05,5.08 0 top
S6  10.16,13.97 0 top
S7  27.94,13.97 0 top
SV1  90.8,38.1 270 top
SV2  17.14,38.1 90 top
SW1  39.75,1.91 90 top
TP1  31.75,32.38 0 bottom
TP2  31.75,34.92 0 bottom
U1  53.98,40.64 45 top
U2  40,11.43 0 top
U3  19.05,54.61 180 top
U4  24.13,54.61 180 top
U6  64.77,12.7 0 bottom
U7  55.88,19.68 270 top
U8  46.99,19.68 0 top
U9  29.21,54.61 180 top
U10  34.29,54.61 180 top
U11  39.37,54.61 180 top
U12  44.45,54.61 180 top
U13  49.53,54.61 180 top
U14  54.61,54.61 180 top
U15  59.69,54.61 180 top
U16  64.77,54.61 180 top
U17  69.85,54.61 180 top
U18  74.93,54.61 180 top
U19  80.01,54.61 180 top
U20  85.09,54.61 180 top
U21  90.17,54.61 180 top
U22  95.25,54.61 180 top

### Tracks (layer width: path | path; a pad name or v marks a point on that pad's centre or on a via)
3.3V  (via drill 0.35)
  Top 0.406: R2.2 41.91,46.99 v41.27,47.62 | v36.19,64.77 20.32,64.77 17.78,67.31 17.78,70.07 J1.6
  Bottom 0.406: v41.27,47.62 36.83,52.07 36.83,64.14 v36.19,64.77
  pour Top (isolate 0.254): 17.78,11.43 17.78,49.53 19.05,50.8 96.52,50.8 99.06,53.34 99.06,60.96 96.52,63.5 88.9,63.5 86.36,66.04 86.36,81.28 86.36,81.28 106.68,81.28 106.68,71.12 106.45,8.89 106.68,-1.27 39.37,-1.27 39.37,6.35 36.83,8.89 20.32,8.89
AREF
  Top 0.406: U1.20 60.89,46.99 C1.2
BTN_A  (via drill 0.35)
  Top 0.406: S3.4 70.87,10.54 | R19.1 71.75,11.43 70.87,10.54 | U1.22 57.78,46.15 v57.78,47.62 | v69.85,11.43 70.74,10.54 70.87,10.54
  Bottom 0.406: v57.78,47.62 57.78,45.72 56.52,44.45 56.52,35.56 69.85,22.23 v69.85,11.43
BTN_B  (via drill 0.35)
  Top 0.406: S2.4 81.03,23.24 | R18.1 81.91,24.13 81.03,23.24 | U1.19 60.12,45.09 v60.32,45.09 | v78.74,25.4 80.9,23.24 81.03,23.24
  Bottom 0.406: v60.32,45.09 57.15,41.91 57.15,36.2 67.94,25.4 v78.74,25.4
BTN_D  (via drill 0.35)
  Top 0.406: S5.4 19.68,3.17 18.2,4.66 R9.1 18.2,13.76 v18.41,13.97 | U1.25 52.7,45.87 v52.7,47.62
  Bottom 0.406: v52.7,47.62 52.7,45.09 53.34,44.45 53.34,29.21 52.7,28.57 20.32,28.57 18.41,26.67 v18.41,13.97
BTN_L  (via drill 0.35)
  Top 0.406: U1.26 51.43,46.01 v51.43,47.62 | S6.4 15.24,12.06 15.87,12.7 v15.87,13.34 15.87,13.97 17.14,15.24 R8.1
  Bottom 0.406: v51.43,47.62 51.43,45.09 52.7,43.81 52.7,29.84 52.07,29.21 17.14,29.21 15.87,27.94 v15.87,13.34
BTN_R  (via drill 0.35)
  Top 0.406: R17.1 29.84,10.16 30.73,11.05 S7.4 v32.38,12.06 | U1.23 56.52,46.01 v56.52,47.62
  Bottom 0.406: v56.52,47.62 56.52,45.72 54.61,43.81 54.61,27.94 53.98,27.3 34.29,27.3 33.02,26.04 33.02,12.7 v32.38,12.06
BTN_U  (via drill 0.35)
  Top 0.406: U1.24 55.24,45.87 v55.24,47.62 | v23.49,20.95 S4.4 21.84,18.67 20.95,17.78 R16.1
  Bottom 0.406: v55.24,47.62 55.24,45.72 53.98,44.45 53.98,28.57 53.34,27.94 25.4,27.94 24.13,26.67 24.13,21.59 v23.49,20.95
CH340_DTR
  Top 0.406: U7.13 56.52,15.88 55.88,15.24 49.53,15.24 48.26,16.51 JP1.2
CH340_RX
  Top 0.406: U7.3 57.78,23.5 57.15,24.13 JP2.2
CH340_TX
  Top 0.406: U7.2 59.05,23.5 59.69,24.13 JP3.2
DBG_LED  (via drill 0.35)
  Top 0.406: U1.17 59.2,41.91 R6.1 62.65,41.24 63.25,40.64 65.41,40.64 v66.04,41.27 | v67.31,59.69 66.67,60.33 63.25,60.33 62.61,60.96 62.61,63.12 61.98,63.75 40.64,63.75 37.34,67.06 24.38,67.06 J1.3 | J1.3
  Bottom 0.406: v66.04,41.27 67.31,42.55 v67.31,59.69
DTR  (via drill 0.35)
  Top 0.305: JP1.1 46.47,17.26 46.99,17.78 46.99,26.04 38.73,34.29 v38.73,38.1
  Top 0.406: C2.2 v41.91,44.45
  Bottom 0.406: v41.91,44.45 38.73,41.27 v38.73,38.1
EN
  Top 0.305: U2.3 40.98,10.16 41.91,10.16 42.55,10.79 R7.1
GND  (via drill 0.35)
  Top 0.305: U2.2 v40,8.26 | C20.1 v62.86,21.59 | U7.1 v60.32,20.95 | U8.2 v45.09,19.68
  Top 0.406: U3.2 19.9,55.23 C4.1 19.9,58 v20.32,58.42 | U4.2 24.98,55.23 C5.1 24.98,58 v25.4,58.42 | U9.2 30.06,55.23 C6.1 30.06,58 v30.48,58.42 | U10.2 35.14,55.23 C7.1 35.14,58 v35.56,58.42 | U11.2 40.28,57.09 C8.1 40.22,58 v40.64,58.42 | U12.2 45.36,57.09 C9.1 45.3,58 v45.72,58.42 | U13.2 50.45,57.09 C10.1 50.38,58 v50.8,58.42 | U14.2 55.52,57.09 C11.1 55.46,58 v55.88,58.42 | U15.2 60.6,57.09 C12.1 60.54,58.2 v60.32,58.42 | U16.2 65.69,57.09 C13.1 65.62,58 v66.04,58.42 | U17.2 70.7,55.23 C14.1 70.7,58 v71.12,58.42 | U18.2 75.78,55.23 C15.1 75.78,58 v76.2,58.42 | U19.2 80.86,55.23 C16.1 80.86,58 v81.28,58.42 | U20.2 85.94,55.23 C17.1 85.94,58 v86.36,58.42 | U21.2 91.02,55.23 C18.1 91.02,58 v91.44,58.42 | U22.2 96.1,55.23 C19.1 96.1,58 v96.52,58.42 | v55.88,31.75 55.88,31.96 C3.1 | Q1.2 v48.89,31.11 | D2.C 64.55,46.79 C1.1 v66.04,46.99 | Q2.2 70.55,40.96 v69.85,40.26 | S6.2 v14.6,15.88 | S4.2 v23.49,24.77 | S7.2 v32.38,15.88 | S3.2 v68.58,5.71 | S2.2 v78.74,18.41 | J3.A1/B12 49.09,6.78 J3.S1 | J3.B1/A12 56.58,6.78 J3.S2 | R5.2 57.5,1.69 J3.S4 | R1.2 48.16,1.69 J3.S3 | C27.2 40.64,26.04 v41.27,25.4 41.49,25.18 C26.2 C21.2 | R11.1 v36.19,18.41 | R10.1 v36.19,20.95 | J2.2 v91.44,62.87 | U1.21 59.05,46.29 v59.05,46.99 | U1.5 49.46,35.56 v48.26,35.56
  Top 0.508: J1.2 20.95,75.53 v20.95,76.2
  Top 0.61: S5.2 v23.49,6.99 | SW1.1 SW1.4 35.73,3 v34.92,3.81 | R1.2 44.29,1.69 | 44.29,1.69 SW1.2 | 44.29,1.69 43.4,2.58 SW1.3
  pour Bottom (isolate 0.254): 0,81.28 111.76,81.28 111.76,-10.16 0,-10.16
LEFT_IN
  Top 0.406: U1.32 48.11,42.55 46.99,42.55 46.35,43.18 SV2.5
LEFT_OUT
  Top 0.406: SV2.4 47.9,40.64 U1.1
N$1
  Top 0.406: Q1.3 51.65,32.17 51.65,34.35 U1.8
N$2
  Top 0.406: U1.7 49.4,33.23 Q1.1
N$3
  Top 0.406: U4.1 26.12,54.06 27.22,55.16 U9.3
N$4
  Top 0.406: U9.1 31.2,54.06 32.3,55.16 U10.3
N$5
  Top 0.406: U3.1 21.04,54.06 22.14,55.16 U4.3
N$6
  Top 0.406: U10.1 36.28,54.06 37.38,55.16 U11.3
N$7
  Top 0.305: R6.2 64.35,42.33 62.45,44.23 D2.A
N$8
  Top 0.406: U11.1 41.36,54.06 42.46,55.16 U12.3
N$9
  Top 0.406: U12.1 46.44,54.06 47.54,55.16 U13.3
N$10
  Top 0.406: U13.1 51.52,54.06 52.62,55.16 U14.3
N$11
  Top 0.406: U14.1 56.6,54.06 57.7,55.16 U15.3
N$12
  Top 0.406: U15.1 61.68,54.06 62.78,55.16 U16.3
N$13
  Top 0.406: U16.1 66.76,54.06 67.86,55.16 U17.3
N$14
  Top 0.406: U17.1 71.84,54.06 72.94,55.16 U18.3
N$15
  Top 0.406: U18.1 76.92,54.06 78.02,55.16 U19.3
N$16
  Top 0.406: U19.1 82,54.06 83.1,55.16 U20.3
N$17
  Top 0.406: U20.1 87.08,54.06 88.18,55.16 U21.3
N$20
  Top 0.406: U21.1 92.16,54.06 93.26,55.16 U22.3
N$24
  Top 0.406: Q2.3 75.56,41.91 76.2,42.55 D8.A 75.77,45.29 LS1.1
N$25
  Top 0.406: R12.2 71.29,42.76 Q2.1
N$27
  Top 0.254: R5.1 55.66,3.39 54.58,4.47 J3.B5
N$30
  Top 0.254: J3.A5 51.58,4.59 50.38,3.39 R1.1
N$34
  Top 0.61: D4.C 54.66,10.79 50.8,10.79 49.53,12.06 45.09,12.06 44.45,11.43 44.45,10.21 D3.C 40.49,6.15 SW1.8
N$35
  Top 0.305: R11.2 39.78,18.21
  Top 0.406: 39.78,18.21 D5.C
N$36
  Top 0.406: R10.2 39.59,23.3 D1.C
NEOPIX  (via drill 0.35)
  Top 0.305: U1.13 57.36,37.89 58.42,36.83 v59.05,36.83
  Top 0.406: v60.32,52.7 16.51,52.7 15.87,53.34 15.87,54.61 16.42,55.16 U3.3
  Bottom 0.406: v59.05,36.83 59.05,41.27 60.96,43.18 60.96,52.07 v60.32,52.7
PE0  (via drill 0.35)
  Top 0.406: U1.3 49.1,37.47 v46.99,37.47
  Bottom 0.406: v46.99,37.47 46.99,35.56 45.09,33.66 33.02,33.66 TP2.TP
PE1  (via drill 0.35)
  Top 0.406: U1.6 49.32,34.29 v47.62,34.29
  Bottom 0.406: TP1.TP 45.72,32.38 v47.62,34.29
RESET  (via drill 0.35)
  Top 0.406: R2.1 v45.3,45.72 C2.1 | U1.29 47.06,46.99 R2.1 | R2.1 45.3,48.05 v45.09,48.26 | v37.46,67.94 27.09,67.94 J1.1
  Bottom 0.406: S1.4 40,43.81 41.91,45.72 v45.3,45.72 | v45.09,48.26 41.91,48.26 38.1,52.07 38.1,67.31 v37.46,67.94
RIGHT_IN
  Top 0.406: U1.9 58.27,32.38 73.66,32.38 81.91,40.64 SV1.2
RIGHT_OUT
  Top 0.406: U1.10 58.77,33.02 72.39,33.02 82.55,43.18 SV1.1
RXI  (via drill 0.35)
  Top 0.406: v45.09,36.83 45.09,30.48 47.62,27.94 59.05,27.94 59.69,27.3 JP3.1 | U1.30 47.83,45.09 v46.99,45.09
  Bottom 0.406: v46.99,45.09 46.35,45.09 44.45,43.18 44.45,37.47 v45.09,36.83
SAO_IO1  (via drill 0.35)
  Top 0.406: J2.5 v96.52,74.3 | U1.15 59.34,38.1 61.59,38.1 v62.86,39.37 | J1.4 19.68,71.75 20.95,71.75 22.86,73.66 23.49,73.66 27.94,69.22 38.1,69.22 42.55,64.77 62.23,64.77 63.5,63.5 v63.5,61.59
  Bottom 0.406: v96.52,74.3 97.79,73.03 97.79,62.23 96.52,60.96 64.13,60.96 v63.5,61.59 62.23,60.33 62.23,40.01 v62.86,39.37
SAO_IO2  (via drill 0.35)
  Top 0.406: J2.6 v96.52,62.87 | U1.16 59.84,38.73 v60.32,38.73 | v61.59,62.87 40,62.87 36.83,66.04 21.81,66.04 J1.5
  Bottom 0.406: v96.52,62.87 95.25,61.59 65.41,61.59 64.13,62.87 v61.59,62.87 61.59,39.37 60.96,38.73 v60.32,38.73
SCL  (via drill 0.35)
  Top 0.406: J2.4 v93.98,62.87 | U1.28 48.26,46.92 v48.26,46.99
  Bottom 0.406: v93.98,62.87 95.25,64.14 95.25,74.81 94.5,75.56 58.42,75.56 48.26,65.41 v48.26,46.99
SDA  (via drill 0.35)
  Top 0.406: J2.3 v93.98,74.3 | U1.27 49.53,46.78 v49.53,47.62
  Bottom 0.406: v93.98,74.3 93.34,74.93 59.05,74.93 49.53,65.41 v49.53,47.62
SENSE_LEFT
  Top 0.406: SV2.1 R3.2 20.74,34.08 26.03,39.37 46.99,39.37 48.26,38.1 48.61,38.1 U1.2
SENSE_RIGHT
  Top 0.406: R4.1 SV1.3 92.71,38.1 93.98,39.37 93.98,43.81 92.71,45.09 82.55,45.09 71.12,33.66 59.26,33.66 U1.11
SPK
  Top 0.406: U1.12 59.76,34.29 67.94,34.29 68.58,34.92 R12.1
TXO  (via drill 0.35)
  Top 0.406: JP2.1 47.74,26.56 43.81,30.48 43.81,37.47 44.45,38.1 v45.72,38.1 | v46.99,43.81 47.97,43.81 U1.31
  Bottom 0.406: v45.72,38.1 45.72,43.18 46.35,43.81 v46.99,43.81
USB_DN  (via drill 0.35)
  Top 0.254: J3.B7 52.07,5.59 v52.58,5.08 53.09,5.59 J3.A7
  Top 0.305: U8.6 53.32,20.34 53.34,20.32 53.98,20.95 | 53.98,20.95 U7.6 | v54.61,20.32 53.98,20.95
  Bottom 0.254: v52.58,5.08 54.61,7.11 v54.61,20.32
USB_DP  (via drill 0.35)
  Top 0.254: J3.B6 53.59,6.79 53.59,7.87 53.09,8.38 | J3.A6 52.58,7.88 53.09,8.38 | 53.09,8.38 v53.09,8.89
  Top 0.305: U8.5 53.34,19.68 v53.98,19.05 54.61,19.05 55.24,19.68 U7.5
  Bottom 0.254: v53.09,8.89 53.98,9.78 v53.98,19.05
VBAT
  Top 0.61: U6.1 D4.A
VBUS  (via drill 0.35)
  Top 0.305: v49.53,18.41 48.89,19.05 47.94,19.05 U8.4
  Top 0.406: J3.A4/B9 50.43,9.26 | 50.43,9.26 v49.53,10.16 D3.A | J3.B4/A9 55.23,8.88 55.23,8.9 54.23,9.91 51.08,9.91 50.43,9.26
  Bottom 0.305: v49.53,10.16 v49.53,18.41
VDD  (via drill 0.35, 0.55)
  Top 0.305: U2.1 39.05,9.21 v37.78,7.94
  Top 0.406: D5.A v36.19,15.88 | R7.2 42.55,19.05 41.91,19.68 | 41.91,19.68 42.55,20.32 C21.1 | 41.91,19.68 v41.27,19.68
  Top 0.61: SW1.7 37.51,7.66 v37.78,7.94
  Bottom 0.406: v37.78,7.94 36.19,9.53 v36.19,15.88 36.19,16.51 36.83,17.14 40.64,17.14 41.27,17.78 v41.27,19.68
  other vias: 13.97,55.24
  pour Top (isolate 0.254): -5.08,78.74 -5.08,-1.27 38.1,-1.27 38.1,6.35 36.83,7.62 19.05,7.62 16.51,10.16 16.51,50.8 17.78,52.07 95.25,52.07 97.79,54.61 97.79,59.69 95.25,62.23 87.63,62.23 85.09,64.77 85.09,81.28 -2.54,81.28

### Text on the board
tPlace: - | SAO | + | RST | SV2 | SV1
bPlace: INSTRUCTIONS | Go meet people at the con. / Plug your badges together. The first / person on the left presses "PLAY". / The badge will start playing their / tunes from left to right. Go make / the coolest musical sequence! | Designed by Lambert Le / October 2024 / Portfolio at lambertle.ca / lambert@protonmail.com | ABOUT THE BADGE | This project is inspired from a mix / of concepts between an old / product I was working on at / my ex-job, a badge I wanted to / make for a rave, the animal / crossing tune creator. / Result: a weird beeper badge XD | RST | Parts of the design from / the Pegasis badge, the / "Hello my name is" badge / was used to rush the design / of this badge. Design will / be on github.com/lle | I would like to thank Angel / for their help in beta-testing / the badge as they are much / more musically inclined than / I will ever be ^.^
_tsilk: PROG PORT :D | + | - | [designed by Lambert, 2024 | click: lambertle.ca | type: lambert@protonmail.com] | BEEP BADGE | D | - | + | INSTRUCTIONS | + | + | PITCH UP / PITCH DOWN / MOVE LEFT / MOVE RIGHT | Connect to others to / make longer musical / sequences | + | + | STOP | + | + | hold + L / or hold + R / to change / tempo | PLAY